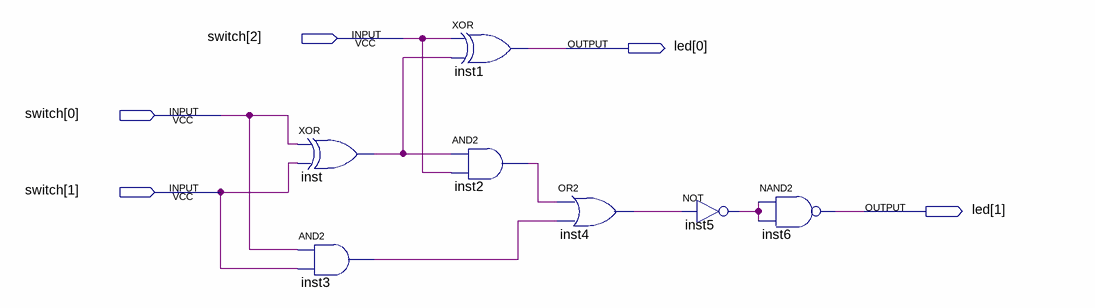
[diagram p0: schematic sheet]
// Quartus schematic pj203.bdf as structural Verilog: 7 symbols, 5 pins
module pj203 (
  input  [2:0] switch,
  output [1:0] led
);

  wire inst2_out, inst3_out, inst4_out, inst5_out, inst_out;

  xor inst (inst_out, switch[0], switch[1]);
  and inst3 (inst3_out, switch[0], switch[1]);
  xor inst1 (led[0], switch[2], inst_out);
  and inst2 (inst2_out, inst_out, switch[2]);
  or inst4 (inst4_out, inst2_out, inst3_out);
  not inst5 (inst5_out, inst4_out);
  nand inst6 (led[1], inst5_out, inst5_out);
endmodule
